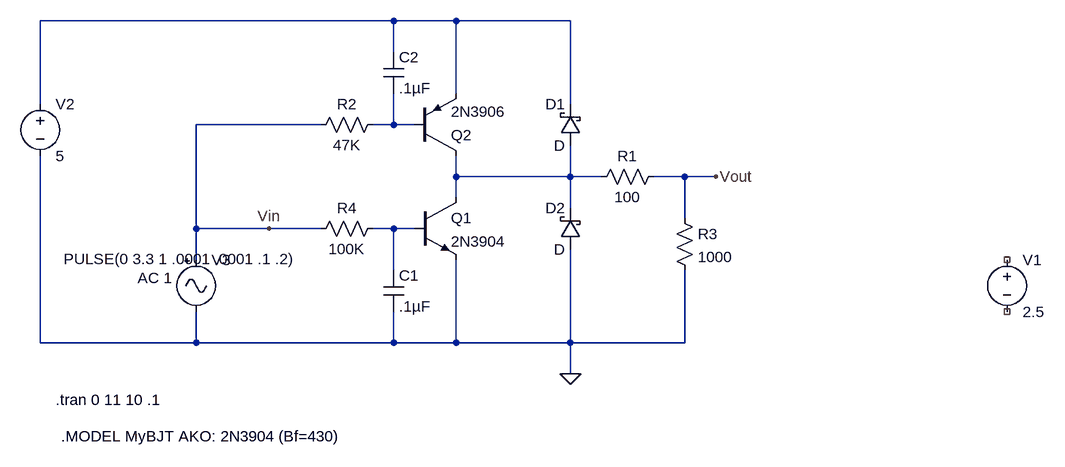
[diagram p0: schematic spank_dig_output.asc]
spank_dig_output.asc, the LTspice schematic file:
Version 4
SHEET 1 1088 784
WIRE 80 128 -464 128
WIRE 176 128 80 128
WIRE 352 128 176 128
WIRE 80 176 80 128
WIRE 176 240 176 128
WIRE -464 256 -464 128
WIRE 352 256 352 128
WIRE -32 288 -224 288
WIRE 80 288 80 240
WIRE 80 288 48 288
WIRE 112 288 80 288
WIRE 176 368 176 336
WIRE 352 368 352 320
WIRE 352 368 176 368
WIRE 400 368 352 368
WIRE 528 368 480 368
WIRE 576 368 528 368
WIRE 176 400 176 368
WIRE 352 416 352 368
WIRE 528 432 528 368
WIRE -224 448 -224 288
WIRE -112 448 -224 448
WIRE -32 448 -112 448
WIRE 80 448 48 448
WIRE 112 448 80 448
WIRE -224 496 -224 448
WIRE 80 512 80 448
WIRE -464 624 -464 336
WIRE -224 624 -224 576
WIRE -224 624 -464 624
WIRE 80 624 80 576
WIRE 80 624 -224 624
WIRE 176 624 176 496
WIRE 176 624 80 624
WIRE 352 624 352 480
WIRE 352 624 176 624
WIRE 528 624 528 512
WIRE 528 624 352 624
WIRE 352 672 352 624
FLAG 352 672 0
FLAG -112 448 Vin
FLAG 576 368 Vout
SYMBOL res 496 352 R90
WINDOW 0 0 56 VBottom 2
WINDOW 3 32 56 VTop 2
SYMATTR InstName R1
SYMATTR Value 100
SYMBOL npn 112 400 R0
SYMATTR InstName Q1
SYMATTR Value 2N3904
SYMBOL res 64 272 R90
WINDOW 0 0 56 VBottom 2
WINDOW 3 32 56 VTop 2
SYMATTR InstName R2
SYMATTR Value 47K
SYMBOL Misc\\signal -224 480 R0
WINDOW 123 -90 44 Left 2
WINDOW 39 0 0 Left 0
WINDOW 3 -204 15 Left 2
SYMATTR Value2 AC 1
SYMATTR Value PULSE(0 3.3 1 .0001 .0001 .1 .2)
SYMATTR InstName V3
SYMBOL voltage -464 240 R0
WINDOW 123 0 0 Left 0
WINDOW 39 0 0 Left 0
SYMATTR InstName V2
SYMATTR Value 5
SYMBOL pnp 112 336 M180
SYMATTR InstName Q2
SYMATTR Value 2N3906
SYMBOL res 64 432 R90
WINDOW 0 0 56 VBottom 2
WINDOW 3 32 56 VTop 2
SYMATTR InstName R4
SYMATTR Value 100K
SYMBOL schottky 368 320 R180
WINDOW 0 24 64 Left 2
WINDOW 3 24 0 Left 2
SYMATTR InstName D1
SYMBOL schottky 368 480 R180
WINDOW 0 24 64 Left 2
WINDOW 3 24 0 Left 2
SYMATTR InstName D2
SYMBOL voltage 1024 480 R0
WINDOW 123 0 0 Left 0
WINDOW 39 0 0 Left 0
SYMATTR InstName V1
SYMATTR Value 2.5
SYMBOL cap 64 512 R0
SYMATTR InstName C1
SYMATTR Value .1µF
SYMBOL cap 64 176 R0
SYMATTR InstName C2
SYMATTR Value .1µF
SYMBOL res 512 416 R0
SYMATTR InstName R3
SYMATTR Value 1000
TEXT -440 712 Left 2 !.tran 0 11 10 .1
TEXT -432 768 Left 2 !.MODEL MyBJT AKO: 2N3904 (Bf=430)

The netlist it stands for:
* spank_dig_output.asc
R1 Vout N003 100
Q1 N003 N004 0 0 2N3904
R2 N002 Vin 47K
V3 Vin 0 PULSE(0 3.3 1 .0001 .0001 .1 .2) AC 1
V2 N001 0 5
Q2 N003 N002 N001 0 2N3906
R4 N004 Vin 100K
D1 N003 N001 D
D2 0 N003 D
V1 NC_01 NC_02 2.5
C1 N004 0 .1µF
C2 N001 N002 .1µF
R3 Vout 0 1000
.model D D
.lib standard.dio
.model NPN NPN
.model PNP PNP
.lib standard.bjt
.tran 0 11 10 .1
.MODEL MyBJT AKO: 2N3904 (Bf=430)
.backanno
.end